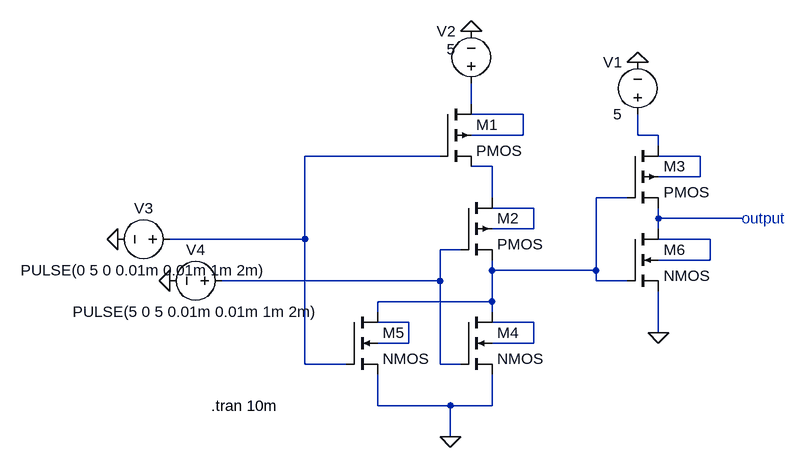
[diagram p0: schematic or gate.asc]
or gate.asc, the LTspice schematic file:
Version 4
SHEET 1 880 852
WIRE 112 320 112 288
WIRE 192 336 112 336
WIRE 192 368 192 336
WIRE 192 368 112 368
WIRE 368 368 368 336
WIRE 400 368 368 368
WIRE 400 384 400 368
WIRE 64 400 -144 400
WIRE 464 400 400 400
WIRE 144 416 112 416
WIRE 464 432 464 400
WIRE 464 432 400 432
WIRE 144 464 144 416
WIRE 352 464 304 464
WIRE 208 480 144 480
WIRE 400 496 400 480
WIRE 528 496 400 496
WIRE 208 512 208 480
WIRE 208 512 144 512
WIRE 400 512 400 496
WIRE -144 528 -144 400
WIRE -144 528 -352 528
WIRE 480 528 384 528
WIRE 96 544 64 544
WIRE 480 560 480 528
WIRE 480 560 400 560
WIRE 144 576 144 560
WIRE 304 576 304 464
WIRE 304 576 144 576
WIRE 64 592 64 544
WIRE 64 592 -272 592
WIRE 304 592 304 576
WIRE 352 592 304 592
WIRE 144 624 144 576
WIRE 144 624 -32 624
WIRE -32 640 -32 624
WIRE 144 640 144 624
WIRE 16 656 -32 656
WIRE 208 656 144 656
WIRE 400 672 400 608
WIRE 16 688 16 656
WIRE 16 688 -32 688
WIRE 208 688 208 656
WIRE 208 688 144 688
WIRE -144 720 -144 528
WIRE -80 720 -144 720
WIRE 64 720 64 592
WIRE 96 720 64 720
WIRE -32 784 -32 736
WIRE 80 784 -32 784
WIRE 144 784 144 736
WIRE 144 784 80 784
WIRE 80 832 80 784
FLAG -432 528 0
FLAG -352 592 0
FLAG 112 208 0
FLAG 368 256 0
FLAG 400 672 0
FLAG 80 832 0
SYMBOL voltage 368 352 R180
WINDOW 0 24 96 Left 2
WINDOW 3 24 16 Left 2
SYMATTR InstName V1
SYMATTR Value 5
SYMBOL voltage 112 304 R180
WINDOW 0 24 96 Left 2
WINDOW 3 24 68 Left 2
WINDOW 123 0 0 Left 0
WINDOW 39 0 0 Left 0
SYMATTR InstName V2
SYMATTR Value 5
SYMBOL nmos4 96 640 R0
SYMATTR InstName M4
SYMBOL nmos4 -80 640 R0
SYMATTR InstName M5
SYMBOL nmos4 352 512 R0
SYMATTR InstName M6
SYMBOL pmos4 64 320 R0
SYMATTR InstName M1
SYMBOL pmos4 96 464 R0
SYMATTR InstName M2
SYMBOL pmos4 352 384 R0
SYMATTR InstName M3
SYMBOL voltage -336 528 R90
WINDOW 0 -32 56 VBottom 2
WINDOW 3 32 56 VTop 2
WINDOW 123 0 0 Left 0
WINDOW 39 0 0 Left 0
SYMATTR InstName V3
SYMATTR Value PULSE(0 5 0 0.01m 0.01m 1m 2m)
SYMBOL voltage -256 592 R90
WINDOW 0 -32 56 VBottom 2
WINDOW 3 32 56 VTop 2
WINDOW 123 0 0 Left 0
WINDOW 39 0 0 Left 0
SYMATTR InstName V4
SYMATTR Value PULSE(5 0 5 0.01m 0.01m 1m 2m)
TEXT 528 496 Left 2 ;output
TEXT -288 784 Left 2 !.tran 10m

The netlist it stands for:
* or gate.asc
V1 N003 0 5
V2 N001 0 5
M4 N007 N011 0 N013 NMOS
M5 N007 N004 0 N012 NMOS
M6 N009 N007 0 N010 NMOS
M1 N001 N004 N006 N002 PMOS
M2 N006 N011 N007 N008 PMOS
M3 N003 N007 N009 N005 PMOS
V3 N004 0 PULSE(0 5 0 0.01m 0.01m 1m 2m)
V4 N011 0 PULSE(5 0 5 0.01m 0.01m 1m 2m)
.model NMOS NMOS
.model PMOS PMOS
.lib standard.mos
* output
.tran 10m
.backanno
.end